# EAGLE design Trail_(Con) (EAGLE 9.6.2)
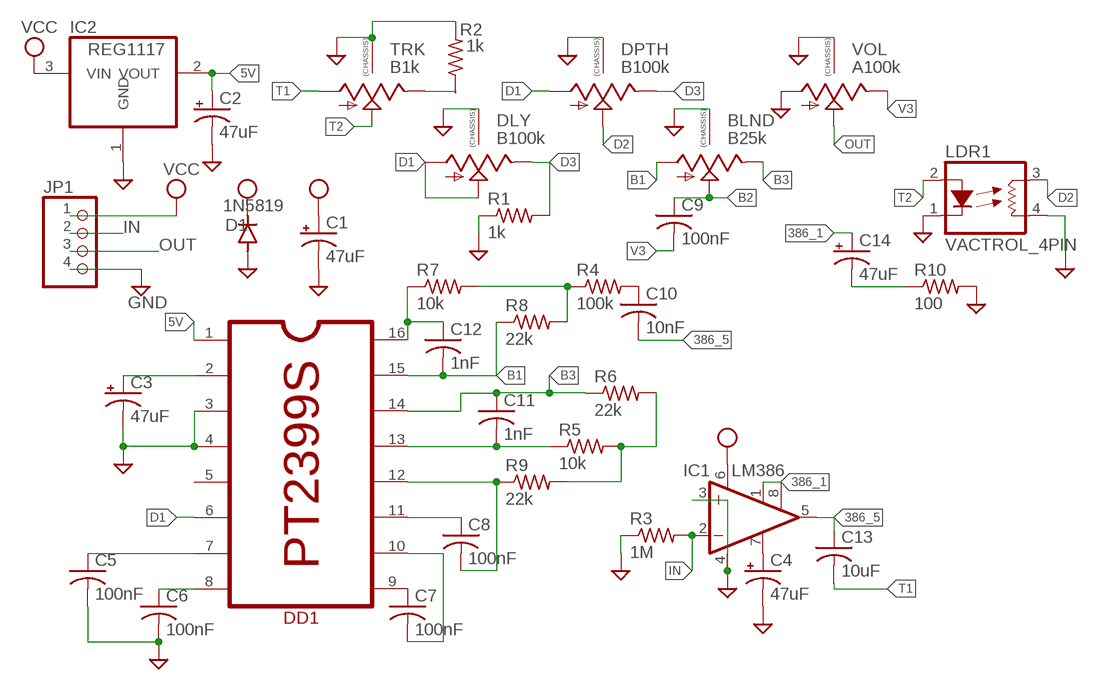
[diagram p0: schematic, sheet 1]

## Parts
BLND  B25k  9MM_SNAP-IN_POT_CHASSIS  [9MM_SNAP-IN_POT]
C1  47uF  CAP_SMD+THRUPAN_B  [PAN_B_SMD+THRU]
C2  47uF  CAP_SMD+THRUPAN_B  [PAN_B_SMD+THRU]
C3  47uF  CAP_SMD+THRUPAN_B  [PAN_B_SMD+THRU]
C4  47uF  CAP_SMD+THRUPAN_B  [PAN_B_SMD+THRU]
C5  100nF  C-USC0402  [C0402]
C6  100nF  C-USC0402  [C0402]
C7  100nF  C-USC0402  [C0402]
C8  100nF  C-USC0402  [C0402]
C9  100nF  C-USC0402  [C0402]
C10  10nF  C-USC0402  [C0402]
C11  1nF  C-USC0402  [C0402]
C12  1nF  C-USC0402  [C0402]
C13  10uF  C-USC0805  [C0805]
C14  47uF  CAP_SMD+THRUPAN_B  [PAN_B_SMD+THRU]
D1  1N5819  DIODE-SOD123  [SOD123]
DD1  PT2399S  [SO-16]
DLY  B100k  9MM_SNAP-IN_POT_CHASSIS  [9MM_SNAP-IN_POT]
DPTH  B100k  9MM_SNAP-IN_POT_CHASSIS  [9MM_SNAP-IN_POT]
IC1  LM386  LM386M-1  [SO08]
IC2  REG1117  [SOT223]
JP1  PINHD-1X4  [1X04]
LDR1  VACTROL_4PIN  [VACTROL_4PIN_VTL5C]
R1  1k  R-US_R0402  [R0402]
R2  1k  R-US_R0402  [R0402]
R3  1M  R-US_R0402  [R0402]
R4  100k  R-US_R0402  [R0402]
R5  10k  R-US_R0402  [R0402]
R6  22k  R-US_R0402  [R0402]
R7  10k  R-US_R0402  [R0402]
R8  22k  R-US_R0402  [R0402]
R9  22k  R-US_R0402  [R0402]
R10  100  R-US_R0402  [R0402]
TRK  B1k  9MM_SNAP-IN_POT_CHASSIS  [9MM_SNAP-IN_POT]
VOL  A100k  9MM_SNAP-IN_POT_CHASSIS  [9MM_SNAP-IN_POT]

## Nets
5V: C2.+ C2.++(+) DD1.1 IC2.2(VOUT)
386_1: C14.+ C14.++(+) IC1.1(GAIN) IC1.8(GAIN)
386_5: C10.2 C13.1 IC1.5(OUT)
B1: BLND.1(A) C12.2 DD1.15 R8.1
B2: BLND.2(S) C9.1
B3: BLND.3(E) C11.1 DD1.14 R6.1
D1: DD1.6 DLY.1(A) DLY.2(S) DPTH.1(A)
D2: DPTH.2(S) LDR1.3(RES1)
D3: DLY.3(E) DPTH.3(E) R1.2
GND: BLND.CHASSIS1 BLND.CHASSIS2 C1.- C1.--(-) C2.- C2.--(-) C3.- C3.--(-) C4.- C4.--(-) C5.2 C6.2 D1.A DD1.3 DD1.4 DLY.CHASSIS1 DLY.CHASSIS2 DPTH.CHASSIS1 DPTH.CHASSIS2 IC1.3(+IN) IC1.4(GND) IC2.1(GND) JP1.4 LDR1.1(LED-) LDR1.4(RES2) R1.1 R2.2 R3.1 R10.2 TRK.CHASSIS1 TRK.CHASSIS2 VOL.1(A) VOL.CHASSIS1 VOL.CHASSIS2
IN: IC1.2(-IN) JP1.2 R3.2
N$1: C3.+ C3.++(+) DD1.2
N$2: C5.1 DD1.7
N$3: C6.1 DD1.8
N$4: C7.1 DD1.9
N$5: C7.2 DD1.10
N$6: C8.1 DD1.11
N$7: C8.2 DD1.12 R9.1
N$8: C11.2 DD1.13 R5.1
N$10: R5.2 R6.2 R9.2
N$11: C12.1 DD1.16 R7.1
N$12: R4.1 R7.2 R8.2
N$13: C10.1 R4.2
N$14: R2.1 TRK.3(E)
N$15: C4.+ C4.++(+) IC1.7(BYPASS)
N$16: C14.- C14.--(-) R10.1
OUT: JP1.3 VOL.2(S)
T1: C13.2 TRK.1(A)
T2: LDR1.2(LED+) TRK.2(S)
V3: C9.2 VOL.3(E)
VCC: C1.+ C1.++(+) D1.C IC1.6(VS) IC2.3(VIN) JP1.1
Unconnected: DD1.5

## Library data of the parts
BLND DLY DPTH TRK VOL = MusicThingModular:9MM_SNAP-IN_POT_CHASSIS: 9mm vertical snap-in pot, Alpha / Panasonic style, with a connection to the metal chassis for grounding
C1-C4 C14 = MusicThingModular:CAP_SMD+THRU
C5-C13 = adafruit:C-US: CAPACITOR, American symbol
D1 = diode:DIODE-: DIODE
DD1 = ic-princeton-technologies:PT2399
IC1 = linear:LM386?-*: Low Voltage Audio Power Amplifier Source: http://cache.national.com/ds/LM/LM386.pdf
IC2 = burr-brown:REG1117: 800mA and 1A Low Dropout (LDO) Positive Regulator 1.8V, 2.5V, 2.85V, 3.3V, 5V, and Adj; MPN: REG1117; OC_FARNELL: 1097566; OC_NEWARK: 14P6981
JP1 = Connector:PINHD-1X4: PIN HEADER; CATEGORY: CONNECTOR; SUB-CATEGORY: PIN-HEADER
LDR1 = MusicThingModular:VACTROL_4PIN: 4 Pin Vactrol Resistive Photocoupler
R1-R10 = adafruit:R-US_: RESISTOR, American symbol

## Board
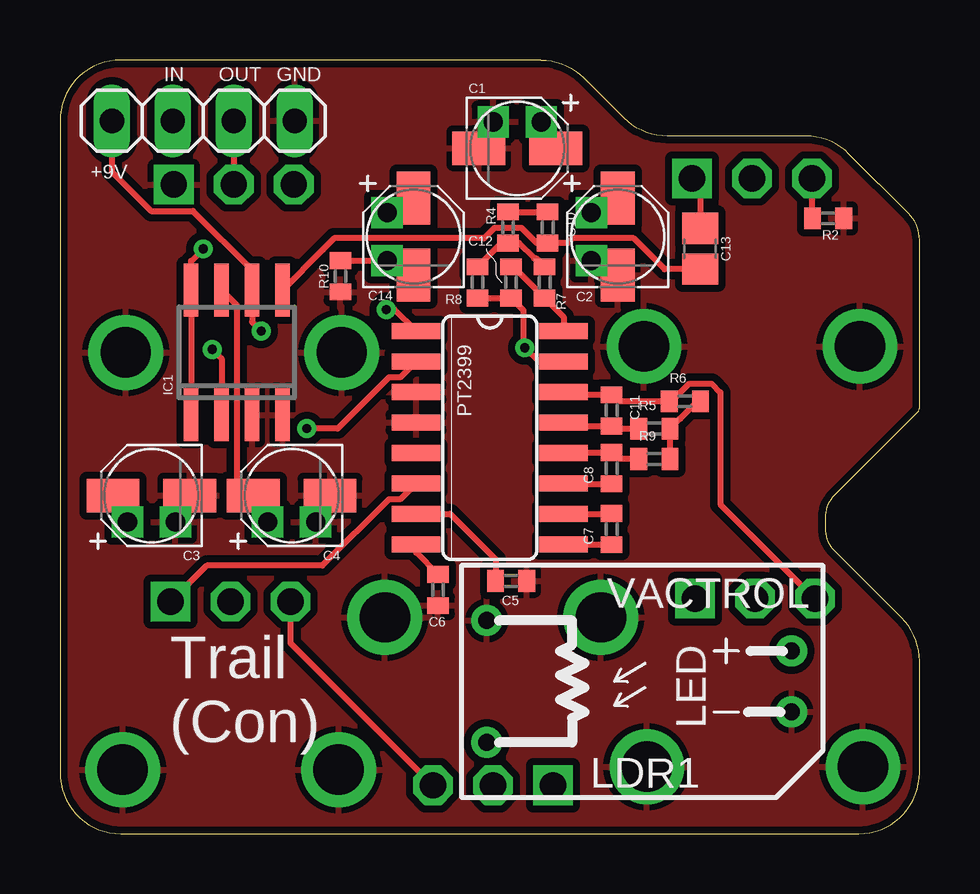
[diagram p1: board, top side]
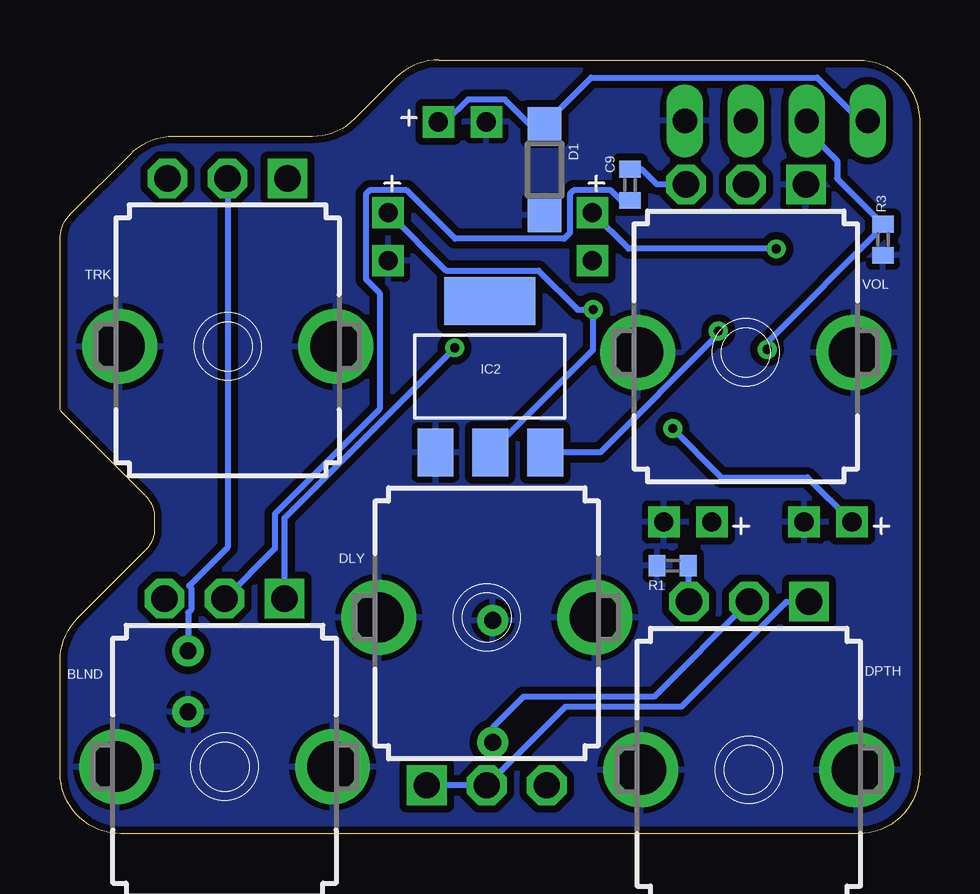
[diagram p2: board, bottom side, seen from below]

Size 35.81 x 32.26 mm. Coordinates in mm from the lower left corner, seen from the top.
Outline: 33.27,0 arc90 35.81,2.54 35.81,7.2 arc45 35.07,9 32.26,11.81 arc-45 31.88,12.73 31.88,13.18 arc-45 32.26,14.1 35.72,17.56 arc45 35.81,17.78 35.81,24.77 arc45 35.37,25.85 32.88,28.34 arc45 31.08,29.08 25.31,29.08 arc-45 23.51,29.83 21.83,31.51 arc45 20.03,32.26 2.54,32.26 arc90 0,29.72 0,2.54 arc90 2.54,0 33.27,0
Copper layers (1*16): Top 0.035mm / dielectric 1.5mm / Bottom 0.035mm
Design rules "default *": minimum track width 6mil, minimum drill 0.35mm, track to track 6mil, track to pad 6mil, pad to pad 6mil, via to via 6mil, smd to smd 6mil, copper to edge 10mil, drill to drill 6mil, minimum pad ring 10mil, minimum via ring 8mil, stop-mask expansion 4mil, vias tented up to drill 0mil, thermal gap 10mil

### Footprints (pad centres in the part's own frame; a part is rotated, then mirrored left to right if it is on the bottom)
9MM_SNAP-IN_POT = drill 1.1 square: 1 -2.5,-7 | drill 1.1 octagon: 2 0,-7; 3 2.5,-7 | drill 2.1 pad 2.794: CHASSIS1 -4.5,0; CHASSIS2 4.5,0
PAN_B_SMD+THRU = smd 2.2 x 1.4: + 1.6,0; - -1.6,0 | drill 0.8 pad 0.9 square: ++ 1,1.1; -- -1,1.1
C0402 = smd 0.7 x 0.9: 1 -0.65,0; 2 0.65,0
C0805 = smd 1.3 x 1.5: 1 -0.85,0; 2 0.85,0
SOD123 = smd 1.4 x 1.4: A 1.9,0; C -1.9,0
SO-16 = smd 0.66 x 2.032: 1 -4.445,-3.073; 2 -3.175,-3.073; 3 -1.905,-3.073; 4 -0.635,-3.073; 5 0.635,-3.073; 6 1.905,-3.073; 7 3.175,-3.073; 8 4.445,-3.073; 9 4.445,3.073; 10 3.175,3.073; 11 1.905,3.073; 12 0.635,3.073; 13 -0.635,3.073; 14 -1.905,3.073; 15 -3.175,3.073; 16 -4.445,3.073
SO08 = smd 0.6 x 2.2: 1 -1.905,-2.6; 2 -0.635,-2.6; 3 0.635,-2.6; 4 1.905,-2.6; 5 1.905,2.6; 6 0.635,2.6; 7 -0.635,2.6; 8 -1.905,2.6
SOT223 = smd 1.499 x 2.007: 1 -2.261,-3.15; 2 0.025,-3.15; 3 2.311,-3.15 | smd 3.81 x 2.007: 4 0,3.15
1X04 = drill 1.016 long: 1 -3.81,0; 2 -1.27,0; 3 1.27,0; 4 3.81,0
VACTROL_4PIN_VTL5C = drill 0.7 pad 1.3: 1 -6.35,1.27; 2 -6.35,-1.27; 3 6.35,2.54; 4 6.35,-2.54
R0402 = smd 0.7 x 0.9: 1 -0.65,0; 2 0.65,0

### Placement (x,y rotation side)
BLND  28.96,2.79 180 bottom
C1  19.05,28.57 0 top
C2  23.24,24.89 90 top
C3  3.81,14.1 180 top
C4  9.65,14.1 180 top
C5  18.8,10.54 0 top
C6  15.75,10.16 270 top
C7  22.99,12.7 90 top
C8  22.99,15.24 90 top
C9  12.06,27.05 90 bottom
C10  20.32,25.27 270 top
C11  22.99,17.65 270 top
C12  18.8,22.99 270 top
C13  26.67,24.38 90 top
C14  14.73,24.89 90 top
D1  15.62,27.69 270 bottom
DD1  17.91,16.51 270 top
DLY  18.03,9.02 0 bottom
DPTH  7.11,2.67 180 bottom
IC1  7.37,20.07 0 top
IC2  17.91,19.05 0 bottom
JP1  5.97,29.72 0 top
LDR1  24.13,6.35 180 top
R1  10.29,11.18 0 bottom
R2  32,25.65 0 top
R3  1.52,24.77 90 bottom
R4  18.67,25.27 90 top
R5  24.77,16.89 0 top
R6  26.04,18.03 0 top
R7  20.19,22.99 90 top
R8  17.4,22.99 90 top
R9  24.77,15.62 0 top
R10  11.68,23.24 270 top
TRK  28.83,20.32 180 bottom
VOL  7.24,20.07 180 bottom

### Tracks (layer width: path | path; a pad name or v marks a point on that pad's centre or on a via)
5V  (via drill 0.38)
  Top 0.254: v13.6,21.85 13.94,21.85 DD1.1 | C2.++ 22.74,26.49 C2.+
  Bottom 0.254: IC2.2 13.6,20.18 v13.6,21.84 | v13.6,21.84 v13.6,21.85 | C2.++ 19.73,23.48 15.89,23.48 14.25,21.84 v13.6,21.84
386_1  (via drill 0.38)
  Top 0.254: C14.++ 14.23,26.49 C14.+ | IC1.1 IC1.8 5.46,23.88 v5.97,24.38
  Bottom 0.254: v5.97,24.38 12.12,24.38 C14.++
386_5
  Top 0.254: C13.1 25.19,23.53 23.9,24.82 21.37,24.82 21.17,24.62 C10.2 19.86,24.62 19.23,25.25 18.1,25.25 17.68,24.82 11.42,24.82 10.96,24.36 10.96,24.35 IC1.5
B1  (via drill 0.38)
  Top 0.254: R8.1 C12.2 19.3,21.83 19.3,20.32 v19.37,20.26 19.94,19.68 DD1.15
  Bottom 0.254: BLND.1 26.46,13.17 v19.37,20.26
B2
  Bottom 0.254: BLND.2 26.86,11.89 26.86,13.34 22.49,17.71 22.49,22.54 23.07,23.12 23.07,26.66 22.91,26.82 21.37,26.82 19.35,24.81 14.8,24.81 14.56,25.05 14.56,26.66 14.4,26.82 12.86,26.82 12.44,26.4 C9.1
B3
  Top 0.254: DD1.14 21.09,18.3 C11.1 23.26,18.03 R6.1 25.49,18.03 26.22,18.76 27.15,18.76 27.52,18.39 27.52,13.73 BLND.3
D1
  Top 0.254: DD1.6 14.17,13.95 13.7,13.95 10.93,11.18 6.12,11.18 DPTH.1
  Bottom 0.254: DLY.1 DLY.2 14.74,5.31 9.91,5.31 5.55,9.67 DPTH.1
D2
  Bottom 0.254: DPTH.2 11.06,5.71 16.51,5.71 17.78,4.45 LDR1.3
D3
  Top 0.254: DLY.3 9.61,7.94 DPTH.3
  Bottom 0.254: R1.2 9.64,9.69 DPTH.3
GND
  Top 0.254: C2.-- 22.64,23.89 C2.-
  pour Bottom (isolate 0.305): -0.76,33.02 -0.76,-0.76 36.83,-0.76 36.83,33.02
  pour Top (isolate 0.305): -1.65,33.02 -1.65,-1.27 36.83,-1.27 36.83,33.02
IN  (via drill 0.38)
  Top 0.254: IC1.2 6.73,19.81 v6.35,20.19
  Bottom 0.254: v6.35,20.19 6.35,20.48 1.52,25.31 R3.2 3.43,27.32 3.43,28.07 4.7,29.34 JP1.2
N$1  (via drill 0.38)
  Top 0.254: C3.++ 2.81,13.5 C3.+ | DD1.2 14.17,19.02 13.7,19.02 11.57,16.89 v10.29,16.89
  Bottom 0.254: v10.29,16.89 8.26,14.86 4.67,14.86 C3.++
N$2
  Top 0.254: DD1.7 16.26,13.34 18.15,11.45 C5.1
N$3
  Top 0.254: C6.1 14.83,11.72 DD1.8
N$4
  Top 0.254: DD1.9 21,12.05 C7.1
N$5
  Top 0.254: DD1.10 22.97,13.34 C7.2
N$6
  Top 0.254: DD1.11 21,14.59 C8.1
N$7
  Top 0.254: R9.1 23.26,15.62 C8.2 22.97,15.88 DD1.12
N$8
  Top 0.254: DD1.13 21.12,17 C11.2 23.1,16.89 R5.1
N$10
  Top 0.254: R9.2 R5.2 25.83,17.3 25.85,17.3 26.58,18.03 R6.2
N$11
  Top 0.254: C12.1 18.89,23.64 R7.1 20.98,21.55 DD1.16
N$12
  Top 0.254: R8.2 18.39,24.62 R4.1 19.12,24.62 19.75,23.99 19.84,23.99 R7.2
N$13
  Top 0.254: R4.2 C10.1
N$14
  Top 0.254: R2.1 31.35,27.3 TRK.3
N$15
  Top 0.254: IC1.7 7.37,22.03 7.37,14.78 C4.+ 8.65,13.5 C4.++
N$16
  Top 0.254: R10.1 C14.-- 14.23,23.29 C14.-
OUT
  Top 0.254: JP1.3 VOL.2
T1
  Top 0.254: TRK.1 26.67,26.98 C13.2
T2
  Bottom 0.254: TRK.2 28.83,11.94 30.43,10.33 30.35,10.25 30.35,9.34 30.48,9.21 LDR1.2
V3
  Bottom 0.254: VOL.3 10.94,27.07 11.57,27.7 C9.2
VCC  (via drill 0.38)
  Top 0.254: C1.++ 20.65,29.07 C1.+ | JP1.1 2.16,27.6 3.8,25.96 5.53,25.96 8,23.5 IC1.6 8,21.34 v8.38,20.95
  Bottom 0.254: C1.++ 19.75,29.68 18.82,30.61 17.28,30.61 16.26,29.59 D1.C 13.69,31.52 4.27,31.52 2.46,29.72 JP1.1 | v8.38,20.95 8.38,20.82 13.31,15.9 IC2.3

### Text on the board
tPlace: IN | OUT | GND | +9V | PT2399 | Trail / (Con)